# EAGLE design rtc-temp-lux-52 (EAGLE 5.07)
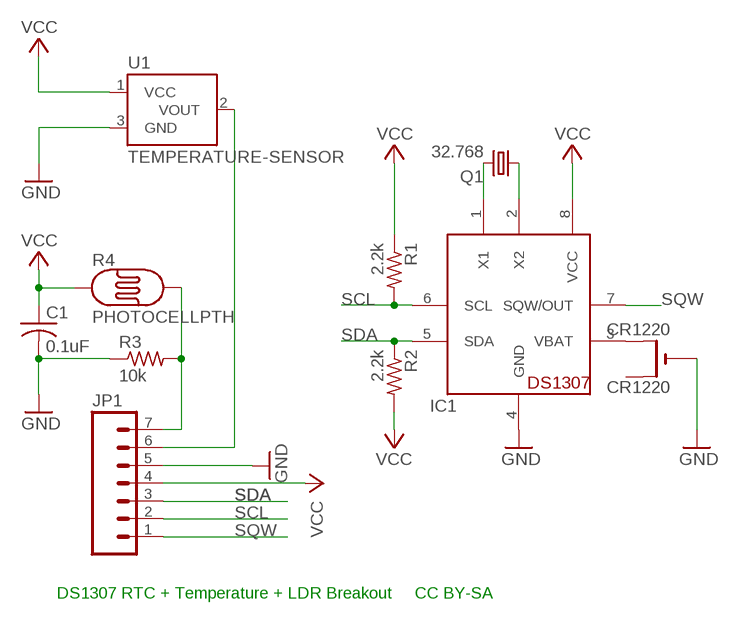
[diagram p0: schematic, sheet 1]

## Parts
C1  0.1uF  C-US025-025X050  [C025-025X050]
CR1220  CR1220  CR1220THM  [CR1220-THM]
IC1  DS1307  [DIL08]
JP1  M07LOCK  [1X07_LOCK]
Q1  32.768  CRYTALTC38H  [TC38H]
R1  2.2k  R-US_0207/10  [0207/10]
R2  2.2k  R-US_0207/10  [0207/10]
R3  10k  R-US_0207/10  [0207/10]
R4  PHOTOCELLPTH  [PHOTOCELL]
U1  TEMPERATURE-SENSOR  [TO-92]

## Nets
GND: C1.2 CR1220.- IC1.4(GND) JP1.5 R3.1 U1.3(GND)
N$2: JP1.6 U1.2(VOUT)
N$3: JP1.7 R3.2 R4.2
N$14: IC1.1(X1) Q1.2
N$15: IC1.2(X2) Q1.1
N$39: CR1220.+2(+1) IC1.3(VBAT)
SCL: IC1.6(SCL) JP1.2 R1.2
SDA: IC1.5(SDA) JP1.3 R2.1
SQW: IC1.7(SQW/OUT) JP1.1
VCC: C1.1 IC1.8(VCC) JP1.4 R1.1 R2.2 R4.1 U1.1(VCC)
Unconnected: CR1220.+1(+)

## Notes on the sheet
- DS1307 RTC + Temperature + LDR Breakout     CC BY-SA

## Library data of the parts
C1 = adafruit:C-US: CAPACITOR, American symbol
CR1220 = adafruit:CR1220: CR1216/CR1220/CR1225 12mm 3V lithium coin cell Great for battery packup. Both SMT and THM holders. Note the THM package has the ground pads on both sides of the PCB so that the masks are the same - this reduces the cost
IC1 = adafruit:DS1307: DS1307 Real time clock (RTC) with battery backup ability. Talk to it via i2c
JP1 = SparkFun:M07: Header 7 Standard 7-pin 0.1" header. Use with straight break away headers (SKU : PRT-00116), right angle break away headers (PRT-00553), swiss pins (PRT-00743), machine pins (PRT-00117), and female headers (PRT-00115). NOTES ON THE VARIANTS LOCK and LOCK_LONGPADS... This footprint was designed to help hold the alignment of a through-hole component (i.e. 7-pin header) while soldering it into place. You may notice that each hole has been shifted either up or down by 0.005 of an inch from it's more standard position (which is usually a perfectly straight line). This slight alteration caused the pins (the squares in the middle) to touch the edges of the holes. Because they are alternating, it causes a "brace" to hold the header in place. 0.005 has proven to be the perfect amount of "off-center" position when using our standard breakaway headers. Although looks a little odd when you look at the bare footprint, once you have a header in there, the alteration is very hard to notice. Also, if you push a header all the way into place, it is covered up entirely on the bottom side. This idea of altering the position of holes to aid alignment will be further integrated into the Sparkfun Library for other footprints. It can help hold any component with 3 or more connection pins.
Q1 = crystal:CRYTAL: CRYSTAL
R1-R3 = adafruit:R-US_: RESISTOR, American symbol
R4 = SparkFun:PHOTOCELL: Photocell Also known as a CdS photoresistor. This is a low cost way to detect light levels. Resistance decreases with more incoming light. SparkFun SKU: SEN-09088
U1 = SparkFun:TEMPERATURE-SENSOR

## Board
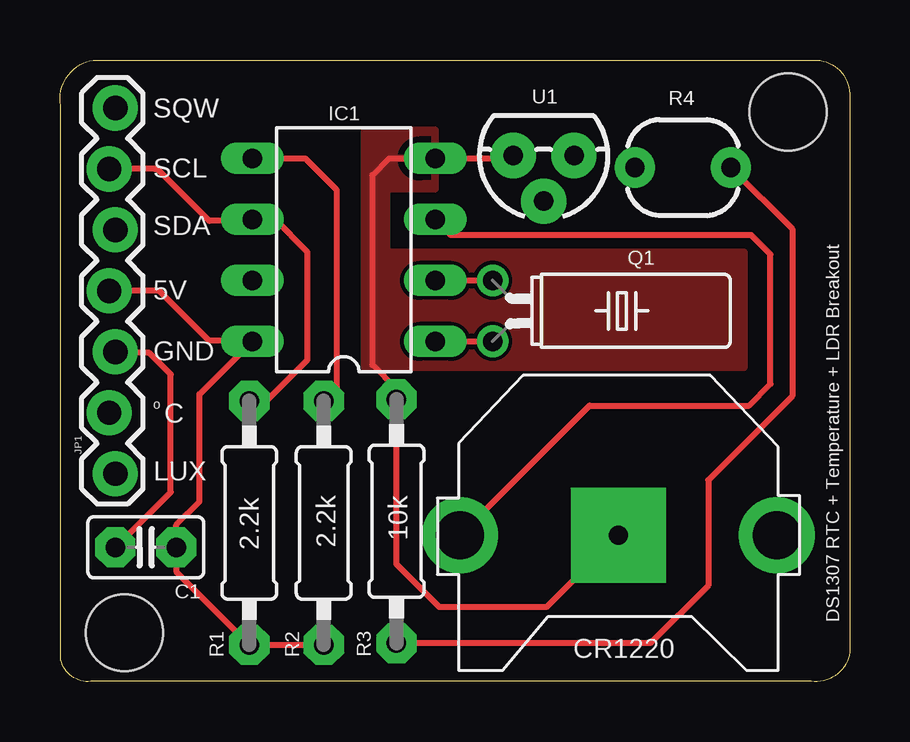
[diagram p1: board, top side]
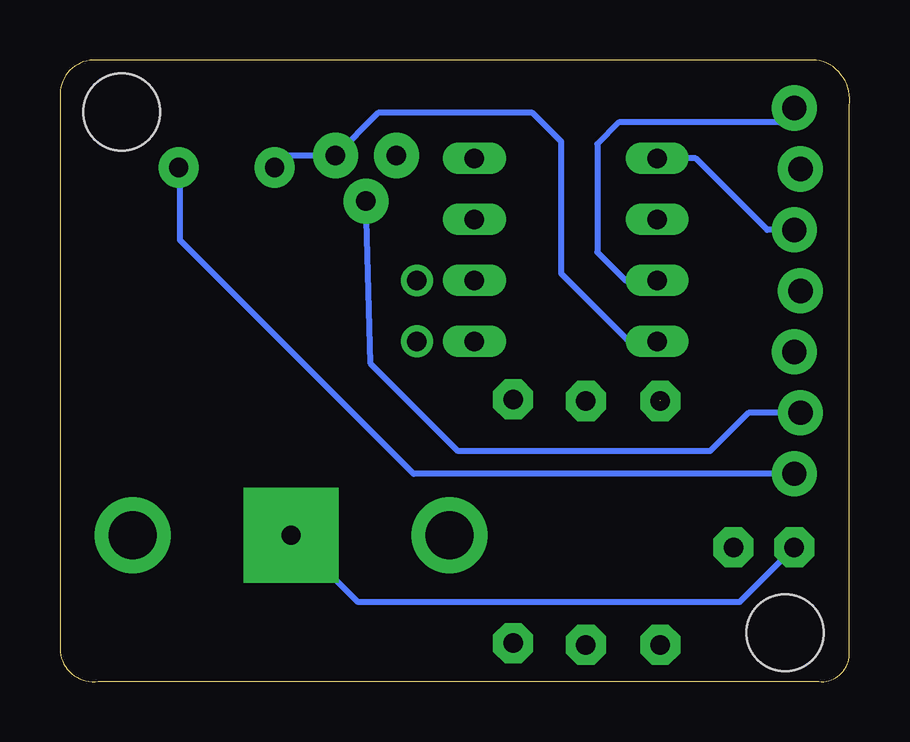
[diagram p2: board, bottom side, seen from below]

Size 32.92 x 25.9 mm. Coordinates in mm from the lower left corner, seen from the top.
Outline: 0.02,24 arc-90 1.39,25.9 31.42,25.9 arc-90 32.92,24.5 32.92,1.23 arc-90 31.32,0.01 1.29,0.01 arc-90 0.02,1.03 0.02,24
Copper layers (1*16): Top 0.035mm / dielectric 1.5mm / Bottom 0.035mm
Design rules "SeeedStudio_2layer_DRU_no_angle_20140221": minimum track width 6mil, minimum drill 12mil, track to track 6mil, track to pad 6mil, pad to pad 6mil, via to via 6mil, smd to smd 0mil, copper to edge 10mil, drill to drill 10mil, minimum pad ring 10mil, minimum via ring 6mil, stop-mask expansion 2mil, vias tented up to drill 100mil, thermal gap 10mil
Holes 3.2 mm at 30.35,23.74 2.69,2.04

### Footprints (pad centres in the part's own frame; a part is rotated, then mirrored left to right if it is on the bottom)
C025-025X050 = drill 0.813 pad 1.676 octagon: 1 -1.27,0; 2 1.27,0
CR1220-THM = drill 2 pad 3.175 round: +1 -6.604,0; +2 6.604,0 | drill 0.8 pad 3.962 square: - 0,0
DIL08 = drill 0.813 long: 1 -3.81,-3.81; 2 -1.27,-3.81; 3 1.27,-3.81; 4 3.81,-3.81; 5 3.81,3.81; 6 1.27,3.81; 7 -1.27,3.81; 8 -3.81,3.81
1X07_LOCK = drill 1.016 pad 1.88 round: 1 0,0.127; 2 2.54,-0.127; 3 5.08,0.127; 4 7.62,-0.127; 5 10.16,0.127; 6 12.7,-0.127; 7 15.24,0.127
TC38H = drill 0.813 round: 1 -1.27,0; 2 1.27,0
0207/10 = drill 0.813 pad 1.676 octagon: 1 -5.08,0; 2 5.08,0
PHOTOCELL = drill 0.8 pad 1.676 round: 1 -2,0; 2 2,0
TO-92 = drill 0.813 pad 1.88 round: 1 -1.27,0; 2 0,1.905; 3 1.27,0

### Placement (x,y rotation side)
C1  3.58,5.6 180 top
CR1220  23.28,6.11 180 top
IC1  11.83,17.99 90 top
JP1  2.18,23.9 270 top
Q1  18.04,15.45 270 top
R1  7.89,6.62 90 top
R2  11,6.62 270 top
R3  14.03,6.68 270 top
R4  25.97,21.42 0 top
U1  20.16,21.92 180 top

### Tracks (layer width: path | path; a pad name or v marks a point on that pad's centre or on a via)
GND
  Top 0.203: R3.1 13.99,10.93
  Top 0.254: CR1220.- 20.28,3.1 15.82,3.1 14.03,4.89 R3.1 14.03,12.19 13.02,13.2 13.02,21.1 13.72,21.8 IC1.4 18.77,21.8 U1.3 | C1.2 4.62,7.9 4.62,12.8 3.72,13.7 2.35,13.7 JP1.5
  Bottom 0.203: CR1220.- 22.88,5.85
  Bottom 0.254: C1.2 4.59,3.31 20.49,3.31 CR1220.-
  pour Top: 12.69,22.97 12.69,13.11 28.5,13.11 28.5,17.89 13.61,17.89 13.61,20.53 15.63,20.53 15.63,22.97
N$2
  Bottom 0.254: U1.2 19.96,13.25 16.32,9.6 5.82,9.6 4.22,11.2 JP1.6
N$3
  Top 0.254: R3.2 24.62,1.6 27.02,4 27.02,8.4 30.52,11.9 30.52,18.87 R4.2
  Bottom 0.254: R4.2 27.92,21.37 27.92,18.4 18.18,8.66 JP1.7
N$14
  Top 0.254: IC1.1 Q1.2
N$15
  Top 0.254: IC1.2 Q1.1
N$39
  Top 0.254: CR1220.+2 22.08,11.5 28.72,11.5 29.62,12.4 29.62,17.8 28.82,18.6 16.3,18.6 IC1.3
SCL  (1 unrouted)
  Top 0.254: 7.9,11.7 8.62,11.7 10.32,13.4 10.32,17.9 8.92,19.3 8.06,19.3 IC1.6 7.96,19.2 6.22,19.2 4.01,21.41 3.96,21.36 JP1.2
SDA
  Top 0.254: R2.1 11.01,11.7 11.52,12.2 11.52,20.5 10.22,21.8 IC1.5
  Bottom 0.254: IC1.5 6.42,21.8 3.44,18.82 JP1.3
SQW
  Bottom 0.254: IC1.7 9.34,16.72 10.52,17.9 10.52,22.4 9.62,23.3 2.91,23.3 JP1.1
VCC
  Top 0.254: R2.2 R1.1 4.85,4.58 C1.1 4.85,6.53 5.82,7.5 5.82,11.98 IC1.8 8,14.2 6.22,14.2 4.14,16.28 JP1.4
  Bottom 0.254: U1.1 21.42,21.94 | U1.1 23.47,21.92 R4.1 | IC1.8 9.2,14.18 12.02,17 12.02,22.5 13.22,23.7 19.65,23.7 U1.1

### Text on the board
tPlace: SQW | SCL | SDA | 5V | GND | o | C | LUX | 2.2k | 2.2k | 10k | DS1307 RTC + Temperature + LDR Breakout
tDocu: CC BY-SA